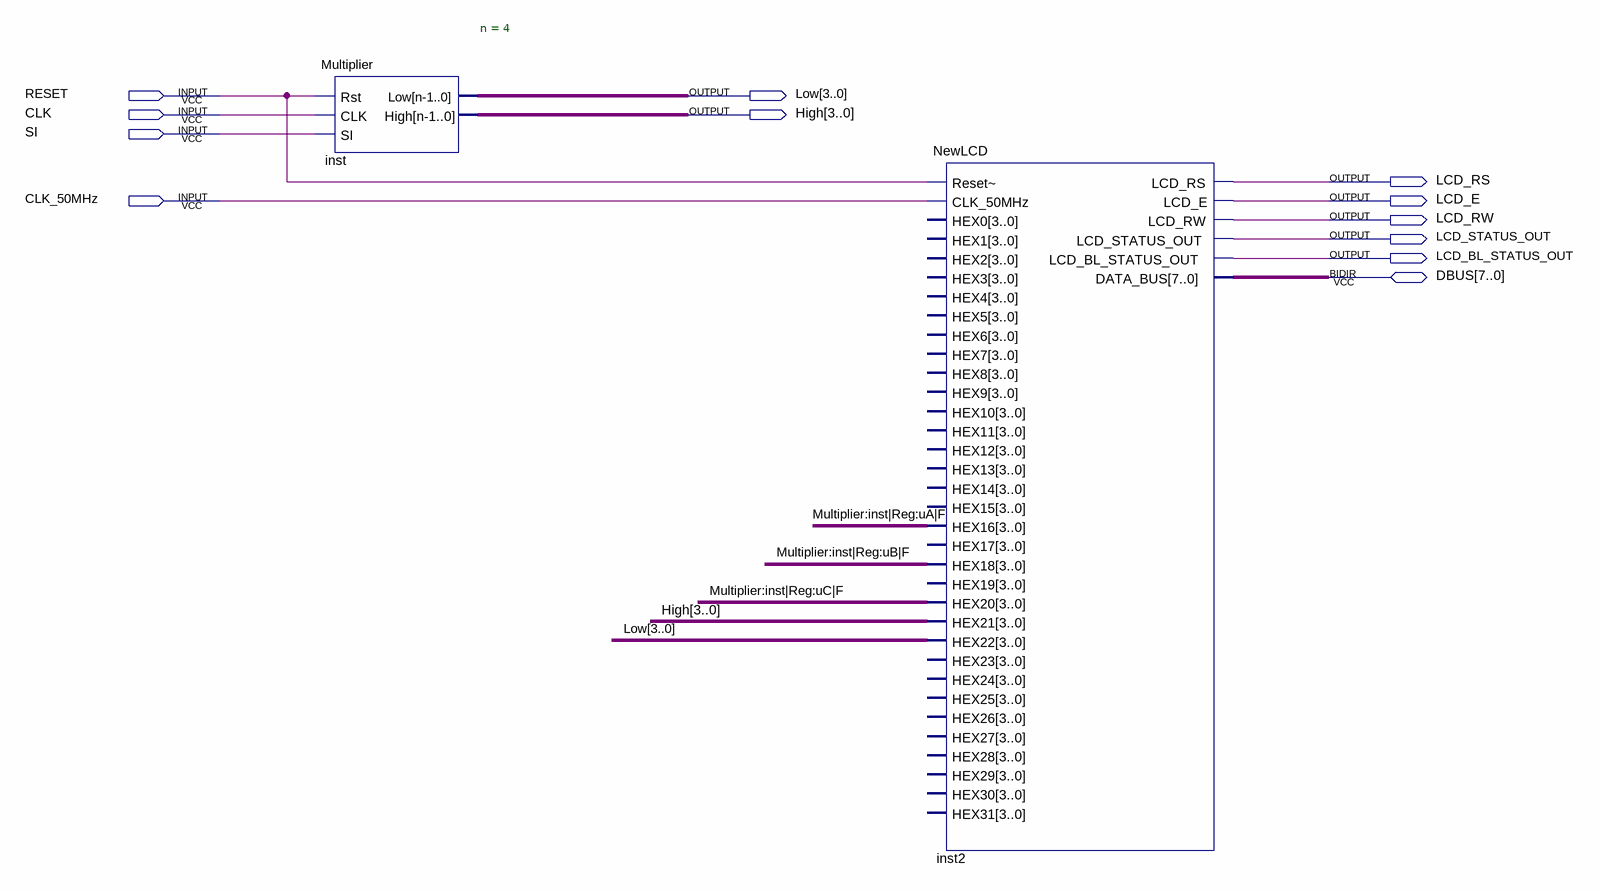
[diagram p0: schematic sheet]
// Quartus schematic MULTIPLIER1.bdf as structural Verilog: 2 symbols, 12 pins
module MULTIPLIER1 (
  input  RESET,
  input  CLK,
  input  SI,
  input  CLK_50MHz,
  inout  [7:0] DBUS,
  output [3:0] Low,
  output [3:0] High,
  output LCD_RS,
  output LCD_E,
  output LCD_RW,
  output LCD_STATUS_OUT,
  output LCD_BL_STATUS_OUT
);

  wire \Multiplier:inst|Reg:uA|F , \Multiplier:inst|Reg:uB|F , \Multiplier:inst|Reg:uC|F ;

  Multiplier #(.n(4)) inst (.Rst(RESET), .CLK(CLK), .SI(SI), .Low(Low), .High(High));
  NewLCD inst2 (
    .\Reset~ (RESET), .CLK_50MHz(CLK_50MHz), .HEX16({4{\Multiplier:inst|Reg:uA|F }}),
    .HEX18({4{\Multiplier:inst|Reg:uB|F }}), .HEX20({4{\Multiplier:inst|Reg:uC|F }}), .HEX21(High),
    .HEX22(Low), .LCD_RS(LCD_RS), .LCD_E(LCD_E), .LCD_RW(LCD_RW), .LCD_STATUS_OUT(LCD_STATUS_OUT),
    .LCD_BL_STATUS_OUT(LCD_BL_STATUS_OUT), .DATA_BUS(DBUS));  // open: HEX0, HEX1, HEX2, HEX3, HEX4, HEX5, HEX6, HEX7, HEX8, HEX9, HEX10, HEX11, HEX12, HEX13, HEX14, HEX15, HEX17, HEX19, HEX23, HEX24, HEX25, HEX26, HEX27, HEX28, HEX29, HEX30, HEX31
endmodule
